# EAGLE design main board +opto 6 motor (EAGLE 9.6.2)
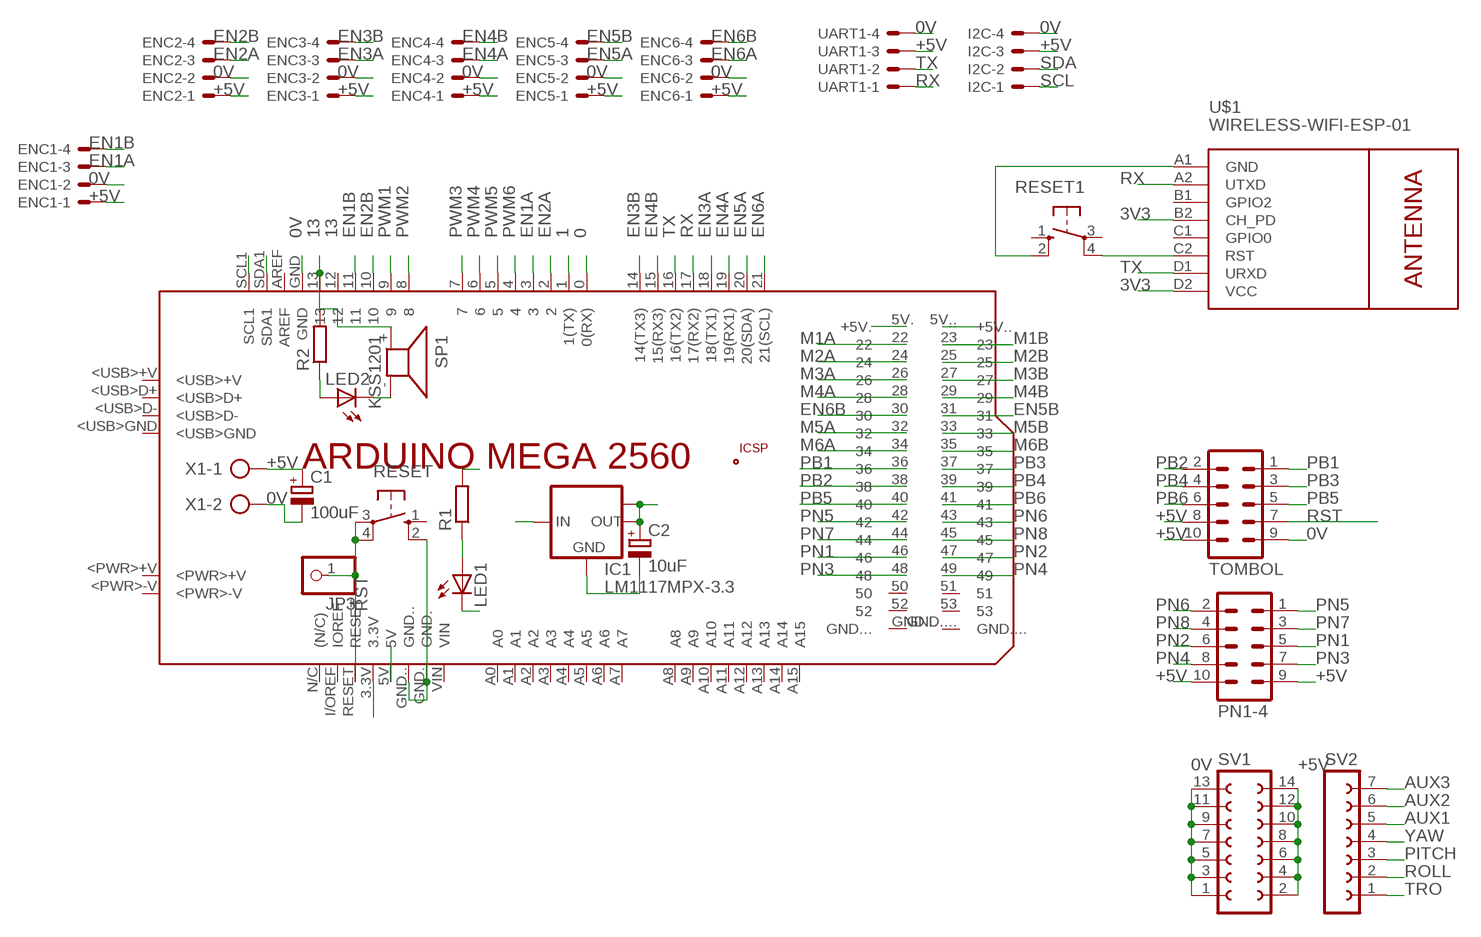
[diagram p0: schematic, sheet 1, part 1 of 2]
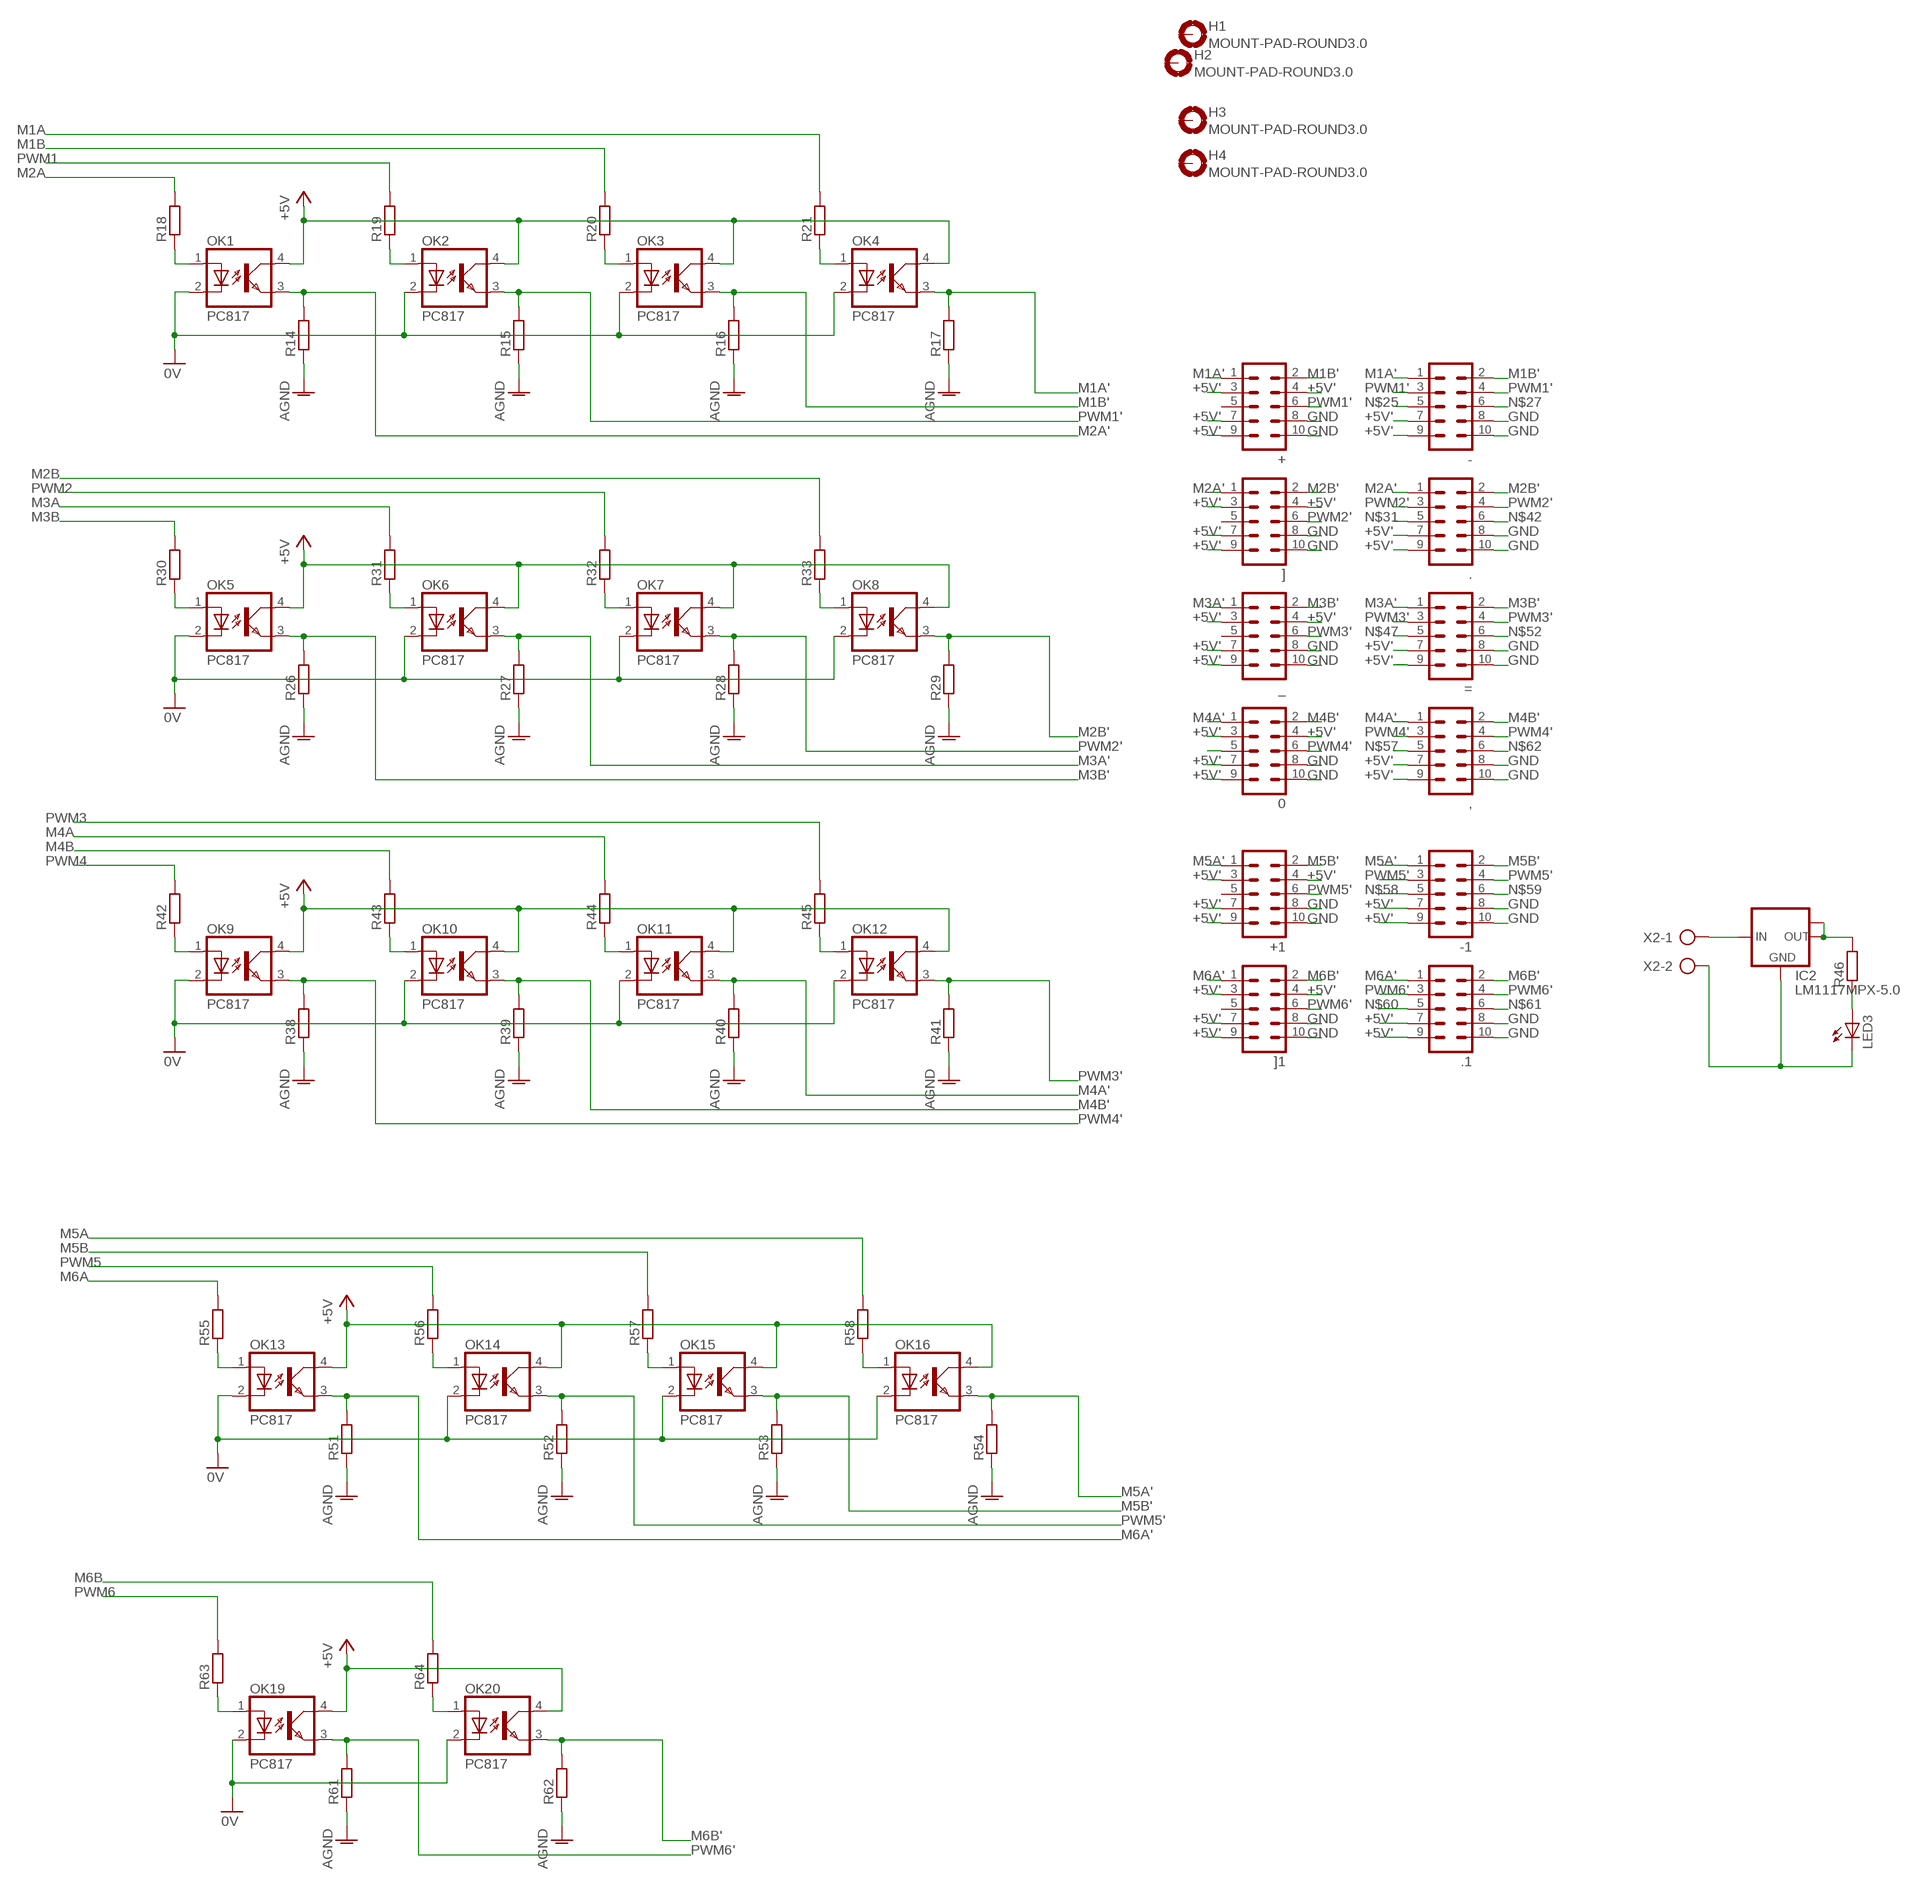
[diagram p1: schematic, sheet 1, part 2 of 2]

## Parts
0  ML10  [ML10]
+  ML10  [ML10]
+1  ML10  [ML10]
,  ML10  [ML10]
-  ML10  [ML10]
-1  ML10  [ML10]
.  ML10  [ML10]
.1  ML10  [ML10]
=  ML10  [ML10]
]  ML10  [ML10]
]1  ML10  [ML10]
_  ML10  [ML10]
C1  100uF  CPOL-EUE2.5-5  [E2,5-5]
C2  10uF  CPOL-EUE2.5-5  [E2,5-5]
ENC1  22-23-2041  [22-23-2041]
ENC2  22-23-2041  [22-23-2041]
ENC3  22-23-2041  [22-23-2041]
ENC4  22-23-2041  [22-23-2041]
ENC5  22-23-2041  [22-23-2041]
ENC6  22-23-2041  [22-23-2041]
H1  MOUNT-PAD-ROUND3.0  [3,0-PAD]
H2  MOUNT-PAD-ROUND3.0  [3,0-PAD]
H3  MOUNT-PAD-ROUND3.0  [3,0-PAD]
H4  MOUNT-PAD-ROUND3.0  [3,0-PAD]
I2C  22-23-2041  [22-23-2041]
IC1  LM1117MPX-3.3  [SOT223]
IC2  LM1117MPX-5.0  [SOT223]
JP3  PINHD-1X1  [1X01]
LED1  LED3MM  [LED3MM]
LED2  LED3MM  [LED3MM]
LED3  LED3MM  [LED3MM]
OK1  PC817  [DIL04]
OK2  PC817  [DIL04]
OK3  PC817  [DIL04]
OK4  PC817  [DIL04]
OK5  PC817  [DIL04]
OK6  PC817  [DIL04]
OK7  PC817  [DIL04]
OK8  PC817  [DIL04]
OK9  PC817  [DIL04]
OK10  PC817  [DIL04]
OK11  PC817  [DIL04]
OK12  PC817  [DIL04]
OK13  PC817  [DIL04]
OK14  PC817  [DIL04]
OK15  PC817  [DIL04]
OK16  PC817  [DIL04]
OK19  PC817  [DIL04]
OK20  PC817  [DIL04]
PCB1  ARDUINO_MEGA2560  [ARDUINO_MEGA2560]
PN1-4  ML10  [ML10]
R1  R-EU_M0805  [M0805]
R2  R-EU_M0805  [M0805]
R14  R-EU_M0805  [M0805]
R15  R-EU_M0805  [M0805]
R16  R-EU_M0805  [M0805]
R17  R-EU_M0805  [M0805]
R18  R-EU_M0805  [M0805]
R19  R-EU_M0805  [M0805]
R20  R-EU_M0805  [M0805]
R21  R-EU_M0805  [M0805]
R26  R-EU_M0805  [M0805]
R27  R-EU_M0805  [M0805]
R28  R-EU_M0805  [M0805]
R29  R-EU_M0805  [M0805]
R30  R-EU_M0805  [M0805]
R31  R-EU_M0805  [M0805]
R32  R-EU_M0805  [M0805]
R33  R-EU_M0805  [M0805]
R38  R-EU_M0805  [M0805]
R39  R-EU_M0805  [M0805]
R40  R-EU_M0805  [M0805]
R41  R-EU_M0805  [M0805]
R42  R-EU_M0805  [M0805]
R43  R-EU_M0805  [M0805]
R44  R-EU_M0805  [M0805]
R45  R-EU_M0805  [M0805]
R46  R-EU_0207/10  [0207/10]
R51  R-EU_M0805  [M0805]
R52  R-EU_M0805  [M0805]
R53  R-EU_M0805  [M0805]
R54  R-EU_M0805  [M0805]
R55  R-EU_M0805  [M0805]
R56  R-EU_M0805  [M0805]
R57  R-EU_M0805  [M0805]
R58  R-EU_M0805  [M0805]
R61  R-EU_M0805  [M0805]
R62  R-EU_M0805  [M0805]
R63  R-EU_M0805  [M0805]
R64  R-EU_M0805  [M0805]
RESET  40-XX  [B3F-40XX]
RESET1  40-XX  [B3F-40XX]
SP1  KSS1201  [KSS1201]
SV1  FE07-2  [FE07-2]
SV2  FE07-1  [FE07]
TOMBOL  ML10  [ML10]
U$1  WIRELESS-WIFI-ESP-01  [WIRELESS-WIFI-ESP-01]
UART1  22-23-2041  [22-23-2041]
X1  AK500/2  [AK500/2]
X2  AK300/2  [AK300/2]

## Nets
0: PCB1.0(0(RX))
0V: C1.- ENC1.2 ENC2.2 ENC3.2 ENC4.2 ENC5.2 ENC6.2 I2C.4 LED1.K(C) LED2.K(C) OK1.2(C) OK2.2(C) OK3.2(C) OK4.2(C) OK5.2(C) OK6.2(C) OK7.2(C) OK8.2(C) OK9.2(C) OK10.2(C) OK11.2(C) OK12.2(C) OK13.2(C) OK14.2(C) OK15.2(C) OK16.2(C) OK19.2(C) OK20.2(C) PCB1.GND PCB1.GND. PCB1.GND.. RESET.2(S1) SP1.- SV1.1 SV1.3 SV1.5 SV1.7 SV1.9 SV1.11 SV1.13 TOMBOL.9 UART1.4 X1.2
1: PCB1.1(1(TX))
3V3: C2.+ IC1.2(OUT) IC1.TAB(OUT1) PCB1.3.3V U$1.B2(CH_PD) U$1.D2(VCC)
13: PCB1.13 R2.2 SP1.+
+5V: C1.+ ENC1.1 ENC2.1 ENC3.1 ENC4.1 ENC5.1 ENC6.1 I2C.3 IC1.3(IN) PCB1.5V PCB1.5V.(+5V.) PCB1.5V..(+5V..) PN1-4.9 PN1-4.10 R1.2 SV1.2 SV1.4 SV1.6 SV1.8 SV1.10 SV1.12 SV1.14 TOMBOL.8 TOMBOL.10 UART1.3 X1.1
+5V': 0.3 0.4 0.7 0.9 +1.3 +1.4 +1.7 +1.9 +.3 +.4 +.7 +.9 ,.7 ,.9 -1.7 -1.9 -.7 -.9 .1.7 .1.9 ..7 ..9 =.7 =.9 ]1.3 ]1.4 ]1.7 ]1.9 ].3 ].4 ].7 ].9 _.3 _.4 _.7 _.9 IC2.2(OUT) IC2.TAB(OUT1) OK1.4(COL) OK2.4(COL) OK3.4(COL) OK4.4(COL) OK5.4(COL) OK6.4(COL) OK7.4(COL) OK8.4(COL) OK9.4(COL) OK10.4(COL) OK11.4(COL) OK12.4(COL) OK13.4(COL) OK14.4(COL) OK15.4(COL) OK16.4(COL) OK19.4(COL) OK20.4(COL) R46.2 ; supply symbol labelled +5V
AUX1: SV2.5
AUX2: SV2.6
AUX3: SV2.7
EN1A: ENC1.3 PCB1.3
EN1B: ENC1.4 PCB1.11
EN2A: ENC2.3 PCB1.2
EN2B: ENC2.4 PCB1.10
EN3A: ENC3.3 PCB1.18(18(TX1))
EN3B: ENC3.4 PCB1.14(14(TX3))
EN4A: ENC4.3 PCB1.19(19(RX1))
EN4B: ENC4.4 PCB1.15(15(RX3))
EN5A: ENC5.3 PCB1.20(20(SDA))
EN5B: ENC5.4 PCB1.31
EN6A: ENC6.3 PCB1.21(21(SCL))
EN6B: ENC6.4 PCB1.30
GND: 0.8 0.10 +1.8 +1.10 +.8 +.10 ,.8 ,.10 -1.8 -1.10 -.8 -.10 .1.8 .1.10 ..8 ..10 =.8 =.10 ]1.8 ]1.10 ].8 ].10 _.8 _.10 IC2.1(GND) LED3.K(C) R14.1 R15.1 R16.1 R17.1 R26.1 R27.1 R28.1 R29.1 R38.1 R39.1 R40.1 R41.1 R51.1 R52.1 R53.1 R54.1 R61.1 R62.1 X2.2 ; supply symbol labelled AGND
M1A: PCB1.22 R21.2
M1A': +.1 -.1 OK4.3(EMIT) R17.2
M1B: PCB1.23 R20.2
M1B': +.2 -.2 OK3.3(EMIT) R16.2
M2A: PCB1.24 R18.2
M2A': ..1 ].1 OK1.3(EMIT) R14.2
M2B: PCB1.25 R33.2
M2B': ..2 ].2 OK8.3(EMIT) R29.2
M3A: PCB1.26 R31.2
M3A': =.1 _.1 OK6.3(EMIT) R27.2
M3B: PCB1.27 R30.2
M3B': =.2 _.2 OK5.3(EMIT) R26.2
M4A: PCB1.28 R44.2
M4A': 0.1 ,.1 OK11.3(EMIT) R40.2
M4B: PCB1.29 R43.2
M4B': 0.2 ,.2 OK10.3(EMIT) R39.2
M5A: PCB1.32 R58.2
M5A': +1.1 -1.1 OK16.3(EMIT) R54.2
M5B: PCB1.33 R57.2
M5B': +1.2 -1.2 OK15.3(EMIT) R53.2
M6A: PCB1.34 R55.2
M6A': .1.1 ]1.1 OK13.3(EMIT) R51.2
M6B: PCB1.35 R64.2
M6B': .1.2 ]1.2 OK20.3(EMIT) R62.2
N$1: RESET1.2(S1) U$1.A1(GND)
N$3: LED1.A R1.1
N$4: LED2.A R2.1
N$6: C2.- IC1.1(GND)
N$9: OK1.1(A) R18.1
N$10: OK2.1(A) R19.1
N$11: OK3.1(A) R20.1
N$12: OK4.1(A) R21.1
N$13: RESET1.4(P1) U$1.C2(RST)
N$18: OK5.1(A) R30.1
N$19: OK6.1(A) R31.1
N$20: OK7.1(A) R32.1
N$21: OK8.1(A) R33.1
N$25: -.5
N$27: -.6
N$29: LED3.A R46.1
N$30: IC2.3(IN) X2.1
N$31: ..5
N$37: OK9.1(A) R42.1
N$38: OK10.1(A) R43.1
N$39: OK11.1(A) R44.1
N$40: OK12.1(A) R45.1
N$42: ..6
N$43: OK13.1(A) R55.1
N$44: OK14.1(A) R56.1
N$45: OK15.1(A) R57.1
N$46: OK16.1(A) R58.1
N$47: =.5
N$50: OK19.1(A) R63.1
N$51: OK20.1(A) R64.1
N$52: =.6
N$57: ,.5
N$58: -1.5
N$59: -1.6
N$60: .1.5
N$61: .1.6
N$62: ,.6
NC4: 0.5
PB1: PCB1.36 TOMBOL.1
PB2: PCB1.38 TOMBOL.2
PB3: PCB1.37 TOMBOL.3
PB4: PCB1.39 TOMBOL.4
PB5: PCB1.40 TOMBOL.5
PB6: PCB1.41 TOMBOL.6
PITCH: SV2.3
PN1: PCB1.46 PN1-4.5
PN2: PCB1.47 PN1-4.6
PN3: PCB1.48 PN1-4.7
PN4: PCB1.49 PN1-4.8
PN5: PCB1.42 PN1-4.1
PN6: PCB1.43 PN1-4.2
PN7: PCB1.44 PN1-4.3
PN8: PCB1.45 PN1-4.4
PWM1: PCB1.9 R19.2
PWM1': +.6 -.3 -.4 OK2.3(EMIT) R15.2
PWM2: PCB1.8 R32.2
PWM2': ..3 ..4 ].6 OK7.3(EMIT) R28.2
PWM3: PCB1.7 R45.2
PWM3': =.3 =.4 _.6 OK12.3(EMIT) R41.2
PWM4: PCB1.6 R42.2
PWM4': 0.6 ,.3 ,.4 OK9.3(EMIT) R38.2
PWM5: PCB1.5 R56.2
PWM5': +1.6 -1.3 -1.4 OK14.3(EMIT) R52.2
PWM6: PCB1.4 R63.2
PWM6': .1.3 .1.4 ]1.6 OK19.3(EMIT) R61.2
ROLL: SV2.2
RST: JP3.1 PCB1.RESET RESET.3(P) RESET.4(P1) TOMBOL.7
RX: PCB1.17(17(RX2)) U$1.A2(UTXD) UART1.1
SCL: I2C.1 PCB1.SCL1
SDA: I2C.2 PCB1.SDA1
TRO: SV2.1
TX: PCB1.16(16(TX2)) U$1.D1(URXD) UART1.2
YAW: SV2.4
Unconnected: +1.5 +.5 ]1.5 ].5 _.5 H1.B3,0(MOUNT) H2.B3,0(MOUNT) H3.B3,0(MOUNT) H4.B3,0(MOUNT) PCB1.12 PCB1.50 PCB1.51 PCB1.52 PCB1.53 PCB1.<PWR>+V PCB1.<PWR>-V PCB1.<USB>+V PCB1.<USB>D+ PCB1.<USB>D- PCB1.<USB>GND PCB1.A0 PCB1.A1 PCB1.A2 PCB1.A3 PCB1.A4 PCB1.A5 PCB1.A6 PCB1.A7 PCB1.A8 PCB1.A9 PCB1.A10 PCB1.A11 PCB1.A12 PCB1.A13 PCB1.A14 PCB1.A15 PCB1.AREF PCB1.GND... PCB1.GND.... PCB1.I/OREF(IOREF) PCB1.N/C((N/C)) PCB1.VIN RESET1.1(S) RESET1.3(P) RESET.1(S) U$1.B1(GPIO2) U$1.C1(GPIO0)

## Library data of the parts
0 + +1 , - -1 . .1 = ] ]1 _ PN1-4 TOMBOL = con-harting-ml:ML10: HARTING; OC_FARNELL: unknown; OC_NEWARK: unknown
C1 C2 = rcl:CPOL-EU: POLARIZED CAPACITOR, European symbol
ENC1-ENC6 I2C UART1 = con-molex:22-23-2041: .100" (2.54mm) Center Header - 4 Pin; MF: MOLEX; MPN: 22-23-2041; OC_FARNELL: 1462920; OC_NEWARK: 38C0355
H1-H4 = holes:MOUNT-PAD-ROUND: MOUNTING PAD, round
IC1 IC2 = lm1117:LM1117MPX-*
JP3 = pinhead:PINHD-1X1: PIN HEADER
LED1-LED3 = led:LED: LED OSRAM: - CHIPLED LG R971, LG N971, LY N971, LG Q971, LY Q971, LO R971, LY R971 LH N974, LH R974 LS Q976, LO Q976, LY Q976 LO Q996 - Hyper CHIPLED LW Q18S LB Q993, LB Q99A, LB R99A - SideLED LS A670, LO A670, LY A670, LG A670, LP A670 LB A673, LV A673, LT A673, LW A673 LH A674 LY A675 LS A676, LA A676, LO A676, LY A676, LW A676 LS A679, LY A679, LG A679 - Hyper Micro SIDELED® LS Y876, LA Y876, LO Y876, LY Y876 LT Y87S - SmartLED LW L88C, LW L88S LB L89C, LB L89S, LG L890 LS L89K, LO L89K, LY L89K LS L896, LA L896, LO L896, LY L896 - TOPLED LS T670, LO T670, LY T670, LG T670, LP T670 LSG T670, LSP T670, LSY T670, LOP T670, LYG T670 LG T671, LOG T671, LSG T671 LB T673, LV T673, LT T673, LW T673 LH T674 LS T676, LA T676, LO T676, LY T676, LB T676, LH T676, LSB T676, LW T676 LB T67C, LV T67C, LT T67C, LS T67K, LO T67K, LY T67K, LW E67C LS E67B, LA E67B, LO E67B, LY E67B, LB E67C, LV E67C, LT E67C LW T67C LS T679, LY T679, LG T679 LS T770, LO T770, LY T770, LG T770, LP T770 LB T773, LV T773, LT T773, LW T773 LH T774 LS E675, LA E675, LY E675, LS T675 LS T776, LA T776, LO T776, LY T776, LB T776 LHGB T686 LT T68C, LB T68C - Hyper Mini TOPLED® LB M676 - Mini TOPLED Santana® LG M470 LS M47K, LO M47K, LY M47K Source: http://www.osram.convergy.de LUXEON: - LUMILED® LXK2-PW12-R00, LXK2-PW12-S00, LXK2-PW14-U00, LXK2-PW14-V00 LXK2-PM12-R00, LXK2-PM12-S00, LXK2-PM14-U00 LXK2-PE12-Q00, LXK2-PE12-R00, LXK2-PE12-S00, LXK2-PE14-T00, LXK2-PE14-U00 LXK2-PB12-K00, LXK2-PB12-L00, LXK2-PB12-M00, LXK2-PB14-N00, LXK2-PB14-P00, LXK2-PB14-Q00 LXK2-PR12-L00, LXK2-PR12-M00, LXK2-PR14-Q00, LXK2-PR14-R00 LXK2-PD12-Q00, LXK2-PD12-R00, LXK2-PD12-S00 LXK2-PH12-R00, LXK2-PH12-S00 LXK2-PL12-P00, LXK2-PL12-Q00, LXK2-PL12-R00 Source: www.luxeon.com KINGBRIGHT: KA-3528ASYC Source: www.kingbright.com
OK1-OK16 OK19 OK20 = optocoupler:PC817: SHARP OPTO COUPLER; MPN: PC817X4J000F; OC_FARNELL: 9707727; OC_NEWARK: 97K7059
PCB1 = Arduino:ARDUINO_MEGA2560: Device for representing an Arduino Mega 2560 board with a footprint in an EAGLE design. Created by Dave Young for Element14. More EAGLE documentation at: http://www.element14.com/community/community/knode/cadsoft_eagle
R1 R2 R14-R21 R26-R33 R38-R46 R51-R58 R61-R64 = rcl:R-EU_: RESISTOR, European symbol
RESET RESET1 = switch-omron:40-XX: OMRON SWITCH; MF: OMRON COMPONENTS USA; MPN: B3F-4000; OC_FARNELL: 176434; OC_NEWARK: 36K3105
SP1 = buzzer:KSS1201: SPEAKER Source: Schukat; OC_FARNELL: unknown; OC_NEWARK: unknown
SV1 = con-lsta:FE07-2: FEMALE HEADER; OC_FARNELL: unknown; OC_NEWARK: unknown
SV2 = con-lsta:FE07-1: FEMALE HEADER; OC_FARNELL: unknown; OC_NEWARK: unknown
U$1 = ESP-01:WIRELESS-WIFI-ESP-01: Wireless Wi-Fi ESP-01 Module based on ESP8266 chip Click here to find device on ebay.com <http://www.ebay.com/sch/esp8266+esp+01+transceiver>
X1 = con-ptr500:AK500/2: CONNECTOR; OC_FARNELL: unknown; OC_NEWARK: unknown
X2 = con-ptr500:AK300/2: CONNECTOR; OC_FARNELL: unknown; OC_NEWARK: unknown

## Board
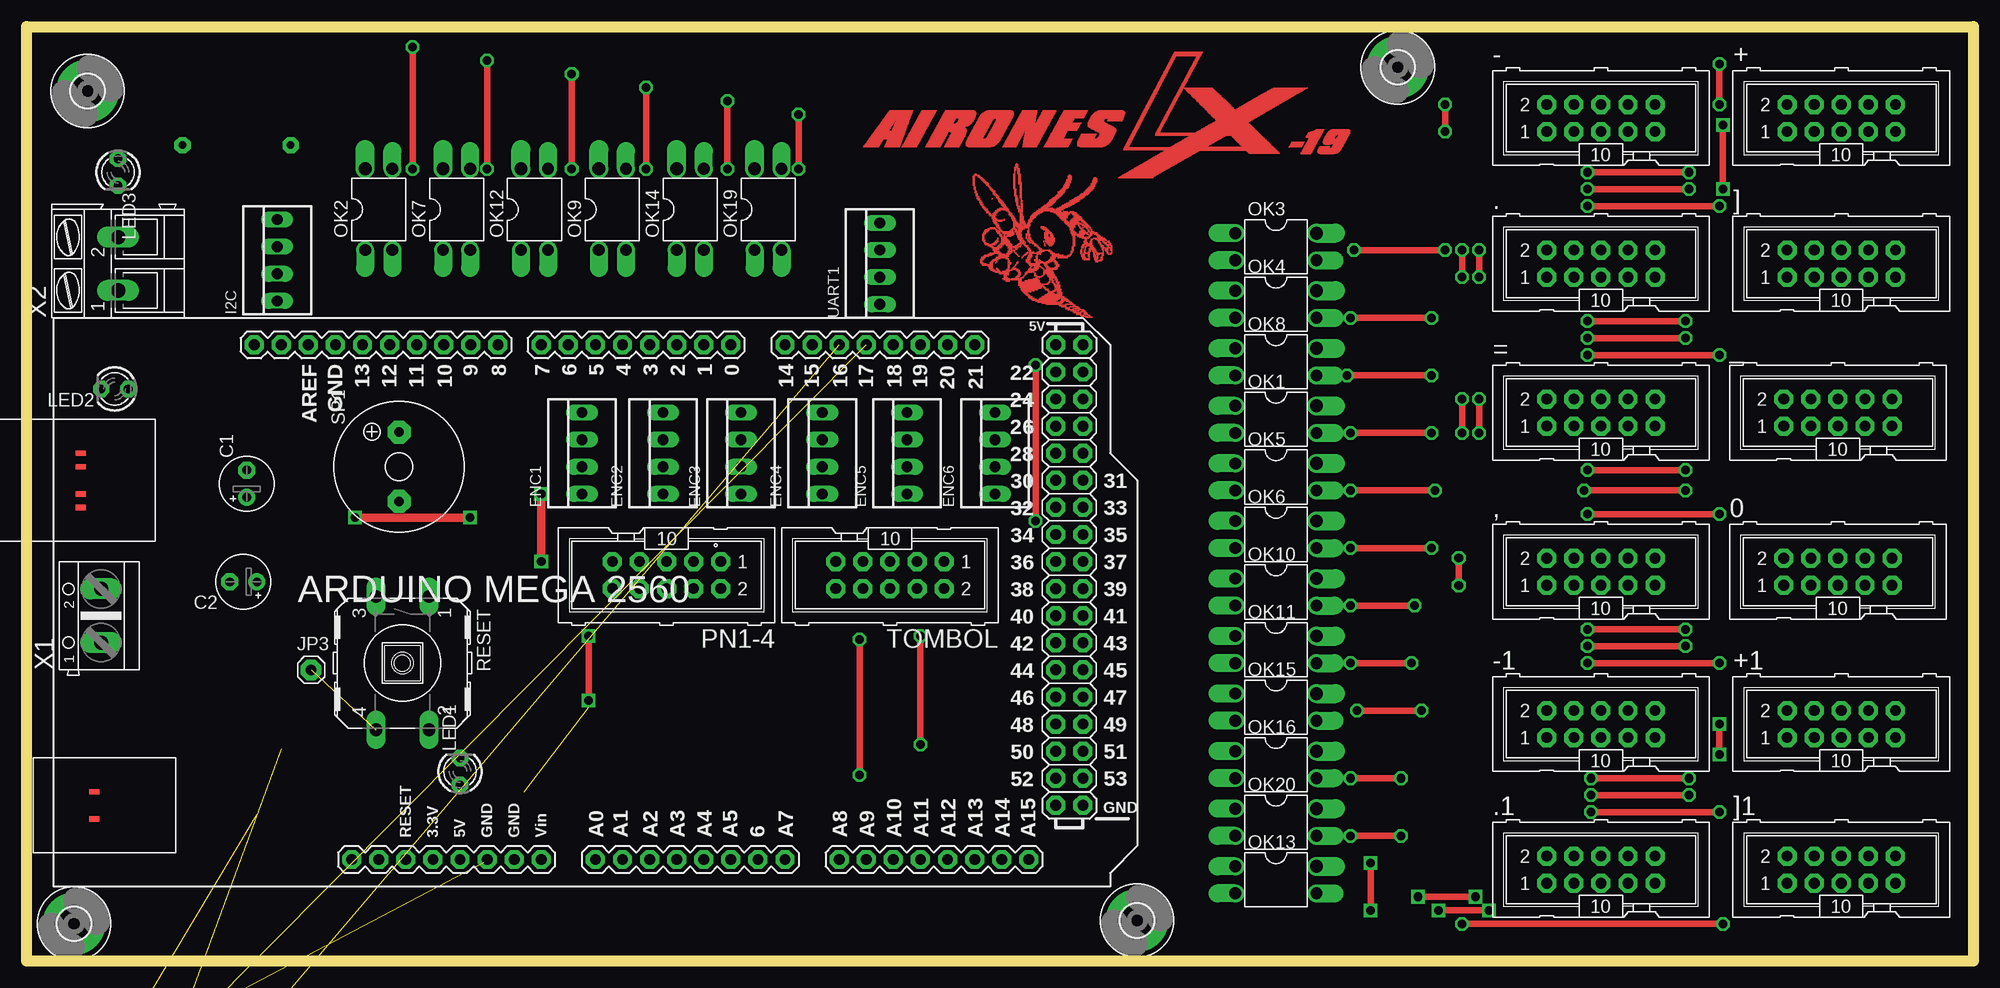
[diagram p2: board, top side]
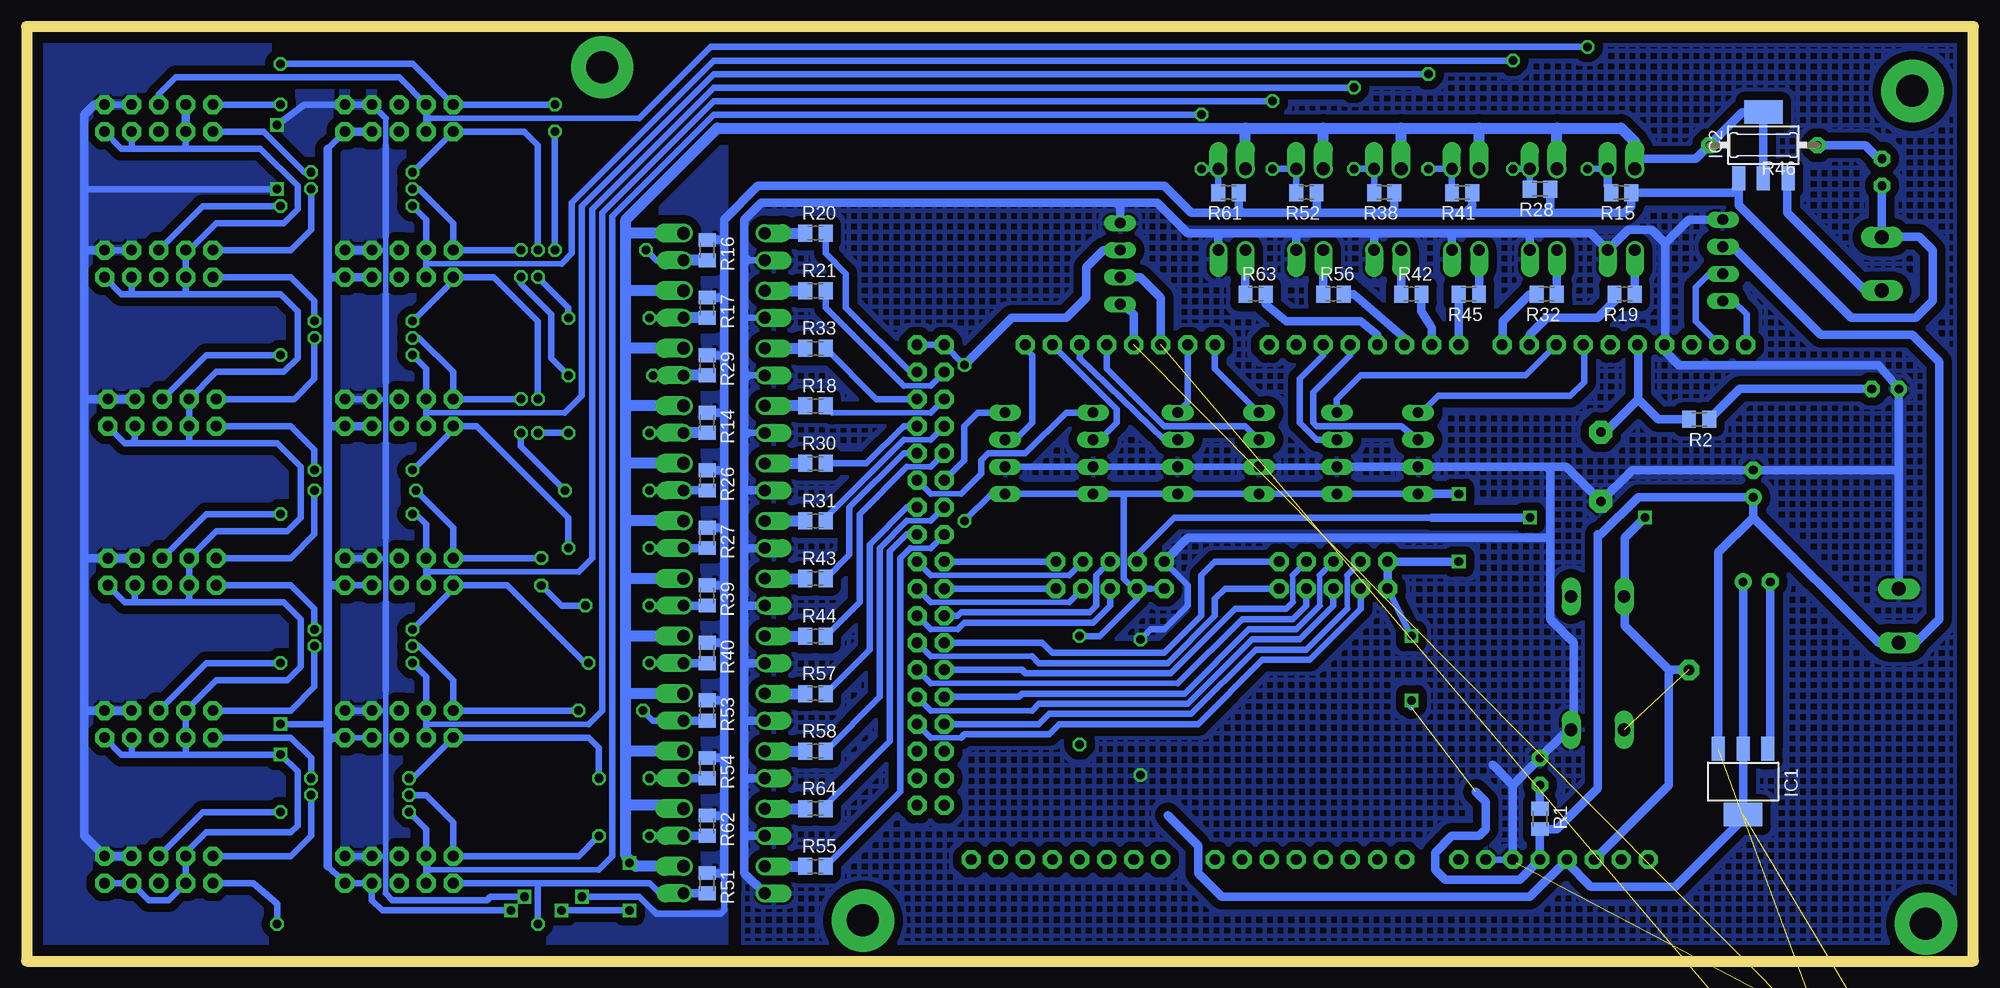
[diagram p3: board, bottom side, seen from below]

Size 182.56 x 87.63 mm. Coordinates in mm from the lower left corner, seen from the top.
Outline: 0,87.63 182.56,87.63 182.56,0 0,0 0,87.63
Copper layers (1*16): Top 0.035mm / dielectric 1.5mm / Bottom 0.035mm
Design rules "default": minimum track width 10mil, minimum drill 24mil, track to track 8mil, track to pad 8mil, pad to pad 8mil, via to via 8mil, smd to smd 8mil, copper to edge 40mil, drill to drill 8mil, minimum pad ring 10mil, minimum via ring 8mil, stop-mask expansion 4mil, vias tented up to drill 0mil, thermal gap 10mil

### Footprints (pad centres in the part's own frame; a part is rotated, then mirrored left to right if it is on the bottom)
ML10 = drill 1 pad 1.778 octagon: 1 -5.08,-1.27; 2 -5.08,1.27; 3 -2.54,-1.27; 4 -2.54,1.27; 5 0,-1.27; 6 0,1.27; 7 2.54,-1.27; 8 2.54,1.27; 9 5.08,-1.27; 10 5.08,1.27
E2,5-5 = drill 0.813 pad 1.6: + -1.27,0 | drill 0.813 pad 1.6 octagon: - 1.27,0
22-23-2041 = drill 1 long: 1 -3.81,0; 2 -1.27,0; 3 1.27,0; 4 3.81,0
3,0-PAD = drill 3 pad 5.842: B3,0 0,0
SOT223 = smd 1.219 x 2.235: 1 -2.311,-3.099; 2 0,-3.099; 3 2.311,-3.099 | smd 3.6 x 2.2: TAB 0,3.099
1X01 = drill 1 pad 1.93 octagon: 1 0,0
LED3MM = drill 0.813 pad 1.524 octagon: A -1.27,0; K 1.27,0
DIL04 = drill 1.1 pad 1.676 offset: 1 -1.27,-3.81; 2 1.27,-3.81; 3 1.27,3.81 | drill 1.2 pad 1.676 offset: 4 -1.27,3.81
ARDUINO_MEGA2560 = drill 1.016 pad 1.778 octagon: 0 63.5,50.8; 1 60.96,50.8; 2 58.42,50.8; 3 55.88,50.8; 3.3V 35.56,2.54; 4 53.34,50.8; 5 50.8,50.8; 5V 38.1,2.54; 5V. 93.98,50.8; 5V.. 96.52,50.8; 6 48.26,50.8; 7 45.72,50.8; 8 41.656,50.8; 9 39.116,50.8; 10 36.576,50.8; 11 34.036,50.8; 12 31.496,50.8; 13 28.956,50.8; 14 68.58,50.8; 15 71.12,50.8; 16 73.66,50.8; 17 76.2,50.8; 18 78.74,50.8; 19 81.28,50.8; 20 83.82,50.8; 21 86.36,50.8; 22 93.98,48.26; 23 96.52,48.26; 24 93.98,45.72; 25 96.52,45.72; 26 93.98,43.18; 27 96.52,43.18; 28 93.98,40.64; 29 96.52,40.64; 30 93.98,38.1; 31 96.52,38.1; 32 93.98,35.56; 33 96.52,35.56; 34 93.98,33.02; 35 96.52,33.02; 36 93.98,30.48; 37 96.52,30.48; 38 93.98,27.94; 39 96.52,27.94; 40 93.98,25.4; 41 96.52,25.4; 42 93.98,22.86; 43 96.52,22.86; 44 93.98,20.32; 45 96.52,20.32; 46 93.98,17.78; 47 96.52,17.78; 48 93.98,15.24; 49 96.52,15.24; 50 93.98,12.7; 51 96.52,12.7; 52 93.98,10.16; 53 96.52,10.16; A0 50.8,2.54; A1 53.34,2.54; A2 55.88,2.54; A3 58.42,2.54; A4 60.96,2.54; A5 63.5,2.54; A6 66.04,2.54; A7 68.58,2.54; A8 73.66,2.54; A9 76.2,2.54; A10 78.74,2.54; A11 81.28,2.54; A12 83.82,2.54; A13 86.36,2.54; A14 88.9,2.54; A15 91.44,2.54; AREF 23.876,50.8; GND 26.416,50.8; GND. 43.18,2.54; GND.. 40.64,2.54; GND... 93.98,7.62; GND.... 96.52,7.62; I/OREF 30.48,2.54; N/C 27.94,2.54; RESET 33.02,2.54; SCL1 18.796,50.8; SDA1 21.336,50.8; VIN 45.72,2.54 | smd 1.016 x 0.508: <PWR>+V 3.81,8.89; <PWR>-V 3.81,6.35; <USB>+V 2.54,40.64; <USB>D+ 2.54,39.37; <USB>D- 2.54,36.83; <USB>GND 2.54,35.56
M0805 = smd 1.3 x 1.6: 1 -0.95,0; 2 0.95,0
0207/10 = drill 0.7 pad 1.524 octagon: 1 -5.08,0; 2 5.08,0
B3F-40XX = drill 1.194 long: 1 -6.248,2.489; 2 6.248,2.489; 3 -6.248,-2.489; 4 6.248,-2.489
KSS1201 = drill 0.914 pad 2.159 octagon: + 3.251,0; - -3.251,0
FE07-2 = drill 0.914: 1 -7.62,1.27 | drill 0.914 octagon: 2 -7.62,-1.27; 3 -5.08,1.27; 4 -5.08,-1.27; 5 -2.54,1.27; 6 -2.54,-1.27; 7 0,1.27; 8 0,-1.27; 9 2.54,1.27; 10 2.54,-1.27; 11 5.08,1.27; 12 5.08,-1.27; 13 7.62,1.27; 14 7.62,-1.27
FE07 = drill 0.813 long: 1 -7.62,0; 2 -5.08,0; 3 -2.54,0; 4 0,0; 5 2.54,0; 6 5.08,0; 7 7.62,0
WIRELESS-WIFI-ESP-01 = drill 1 square: A1 -8.89,3.81; D1 -8.89,-3.81 | drill 1: A2 -11.43,3.81; B1 -8.89,1.27; B2 -11.43,1.27; C1 -8.89,-1.27; C2 -11.43,-1.27; D2 -11.43,-3.81
AK500/2 = drill 1.321 long: 1 -2.515,0; 2 2.515,0
AK300/2 = drill 1.321 long: 1 -2.515,0; 2 2.489,0

### Placement (x,y rotation side)
0  169.86,36.51 0 top
+  170.18,79.06 0 top
+1  170.18,22.22 0 top
,  147.64,36.51 0 top
-  147.64,79.06 0 top
-1  147.64,22.22 0 top
.  147.64,65.41 0 top
.1  147.64,8.57 0 top
=  147.64,51.44 0 top
]  170.18,65.41 0 top
]1  170.18,8.57 0 top
_  169.86,51.44 0 top
C1  20.64,44.77 90 top
C2  20.32,35.56 180 top
ENC1  52.07,47.62 90 top
ENC2  59.69,47.62 90 top
ENC3  66.99,47.62 90 top
ENC4  74.61,47.62 90 top
ENC5  82.55,47.62 90 top
ENC6  90.81,47.62 90 top
H1  5.72,81.6 180 top
H2  128.59,83.82 0 top
H3  104.14,3.81 0 top
H4  4.45,3.49 0 top
I2C  23.5,65.72 90 top
IC1  21.59,16.83 180 bottom
IC2  19.69,76.52 0 bottom
JP3  26.67,27.3 0 top
LED1  40.64,17.78 90 top
LED2  8.26,53.66 180 top
LED3  8.57,73.98 270 top
OK1  117.16,50.8 270 top
OK2  33.02,70.48 0 top
OK3  117.16,66.99 270 top
OK4  117.16,61.6 270 top
OK5  117.16,45.4 270 top
OK6  117.16,40.01 270 top
OK7  40.32,70.48 0 top
OK8  117.16,56.2 270 top
OK9  54.93,70.48 0 top
OK10  117.16,34.61 270 top
OK11  117.16,29.21 270 top
OK12  47.62,70.48 0 top
OK13  117.16,7.62 270 top
OK14  62.23,70.48 0 top
OK15  117.16,23.81 270 top
OK16  117.16,18.41 270 top
OK19  69.53,70.48 0 top
OK20  117.16,13.02 270 top
PCB1  2.54,6.99 0 top
PN1-4  60.01,36.2 180 top
R1  40.64,13.33 270 bottom
R2  25.72,50.8 180 bottom
R14  118.75,50.48 270 bottom
R15  33.02,72.07 180 bottom
R16  118.75,66.67 270 bottom
R17  118.75,61.28 270 bottom
R18  108.59,52.07 0 bottom
R19  32.7,62.55 180 bottom
R20  108.59,68.26 0 bottom
R21  108.59,62.87 0 bottom
R26  118.75,45.09 270 bottom
R27  118.75,39.69 270 bottom
R28  40.64,72.39 180 bottom
R29  118.75,55.88 270 bottom
R30  108.59,46.67 0 bottom
R31  108.59,41.28 0 bottom
R32  40,62.55 180 bottom
R33  108.59,57.47 0 bottom
R38  55.25,72.07 180 bottom
R39  118.75,34.29 270 bottom
R40  118.75,28.89 270 bottom
R41  47.94,72.07 180 bottom
R42  52.71,62.55 0 bottom
R43  108.59,35.88 0 bottom
R44  108.59,30.48 0 bottom
R45  47.31,62.55 180 bottom
R46  19.69,76.52 180 bottom
R51  118.75,7.3 270 bottom
R52  62.55,72.07 180 bottom
R53  118.75,23.49 270 bottom
R54  118.75,18.1 270 bottom
R55  108.59,8.89 0 bottom
R56  60.01,62.55 0 bottom
R57  108.59,25.08 0 bottom
R58  108.59,19.68 0 bottom
R61  69.85,72.07 180 bottom
R62  118.75,12.7 270 bottom
R63  67.31,62.55 0 bottom
R64  108.59,14.29 0 bottom
RESET  35.24,27.94 270 top
RESET1  4.47,-46.62 0 top  (outside the outline)
SP1  34.92,46.36 90 top
SV1  5.72,-7.62 0 top  (outside the outline)
SV2  5.72,-11.43 0 top  (outside the outline)
TOMBOL  80.96,36.2 180 top
U$1  8.97,-27.82 0 top  (outside the outline)
UART1  80.01,65.41 90 top
X1  6.98,32.39 90 top
X2  8.57,65.41 90 top

### Tracks (layer width: path | path; a pad name or v marks a point on that pad's centre or on a via)
0V  (via drill 0.8 pad 1.27)  (7 unrouted)
  Top 0.61: v78.1,30.16 v78.1,17.46
  Bottom 0.61: ENC6.2 ENC5.2 ENC4.2 ENC3.2 ENC2.2 | 42.86,9.21 PCB1.GND.. PCB1.GND. | TOMBOL.9 73.66,35.24 73.66,33.34 75.88,31.11 77.15,31.11 v78.1,30.16 | OK1.2 114.94,49.53 | OK8.2 115.25,54.93 | OK4.2 114.94,60.32 115.25,60.64 | OK3.2 115.25,65.72
  Bottom 0.813: 41.59,68.26 35.88,68.26 OK2.2 32.39,68.58 30.16,68.58 28.89,67.31 | 41.59,68.26 48.9,68.26 | 48.9,68.26 56.2,68.26 | 56.2,68.26 63.5,68.26 | 63.5,68.26 70.8,68.26 | 115.25,66.04 115.25,69.53 113.66,71.12 80.33,71.12 | 115.25,66.04 115.25,65.72 115.25,60.64 115.25,54.93 115.25,54.61 | 115.25,54.61 115.25,49.21 | 115.25,49.21 115.25,44.13 | 115.25,44.13 115.25,38.73 | 115.25,38.73 115.25,33.34 | 115.25,33.34 115.25,27.62 | 115.25,27.62 115.25,22.54 | 115.25,22.54 115.25,16.83 | 115.25,16.83 115.25,11.75 | 115.25,11.75 115.25,8.25 OK13.2 | OK20.2 115.25,11.75 | OK16.2 114.94,17.14 115.25,16.83 | OK15.2 115.25,22.54 | OK11.2 114.94,27.94 115.25,27.62 | OK10.2 115.25,33.34 | OK6.2 115.25,38.73 | OK5.2 115.25,44.13 | 114.94,49.53 115.25,49.21 | 114.94,54.93 115.25,54.61 | 114.94,65.72 115.25,66.04 | OK19.2 70.8,68.26 | OK14.2 63.5,68.26 | OK9.2 56.2,68.26 | OK12.2 48.9,68.26 | OK7.2 41.59,68.26 | 28.89,67.31 28.89,57.85 PCB1.GND 28.96,57.21 27.62,55.88 8.89,55.88 LED2.K 6.98,46.04 | 70.8,68.26 73.66,68.26 76.52,71.12 80.33,71.12 | UART1.4 80.01,70.8 80.33,71.12 | I2C.4 26.67,69.53 28.89,67.31 | 37.47,21.43 37.47,29.85 39.69,32.07 39.69,39.69 | 37.47,21.43 37.47,21.27 38.42,21.27 LED1.K 40.96,19.05 40.96,18.73 43.18,16.51 | 37.47,21.43 RESET.2 | 43.18,16.51 PCB1.GND.. | X1.2 6.98,46.04 | 6.98,46.04 C1.- 31.99,46.04 SP1.- 38.18,46.36 40,46.36 | ENC2.2 ENC1.2 40,46.36 | 39.69,39.69 73.66,39.69 TOMBOL.9 | 45.09,18.41 43.18,16.51 | 39.69,39.69 39.69,46.04 40,46.36
  pour Bottom (isolate 0.8, hatched): -1.13,88.68 115.06,88.68 115.37,-1.02 -1.13,-0.92
3V3  (2 unrouted)
  Bottom 0.813: 75.56,13.65 72.71,10.79 72.71,8.25 70.49,6.03 41.59,6.03 PCB1.3.3V 38.1,9.21 35.88,6.99 27.94,6.99 21.59,13.33 IC1.TAB IC1.2 C2.+
13
  Bottom 0.813: SP1.+ 34.53,49.61 31.43,52.71 | 31.43,52.71 31.43,57.72 PCB1.13 | R2.2 29.53,50.8 31.43,52.71
+5V  (via drill 0.8 pad 1.27)  (8 unrouted)
  Top 0.61: v94.62,41.28 v94.62,55.88 | v83.82,30.48 v83.82,20.32 | v52.71,30.48 v52.71,24.45
  Top 0.813: v48.26,37.47 v48.26,43.82
  Bottom 0.51: TOMBOL.10 77.15,34.93 TOMBOL.8
  Bottom 0.61: v94.62,41.28 92.08,43.82 ENC6.1 ENC5.1 79.69,43.82 | v94.62,55.88 PCB1.5V. PCB1.5V.. | 79.69,43.82 ENC4.1 ENC3.1 ENC2.1 ENC1.1 | TOMBOL.10 75.88,35.24 | TOMBOL.8 78.42,33.97 81.91,30.48 v83.82,30.48 | PN1-4.10 v52.71,30.48 | v52.71,24.45 52.71,23.81 | 77.15,34.93 78.74,34.93 79.69,35.88 79.69,43.82
  Bottom 0.813: UART1.3 81.6,66.67 83.19,65.09 83.19,62.23 85.09,60.32 90.17,60.32 v94.62,55.88 | 20.64,41.59 8.89,29.85 8.26,29.85 8.23,29.87 X1.1 6.96,29.85 5.4,29.85 3.17,32.07 3.17,56.2 5.72,58.74 14.29,58.74 22.54,66.99 I2C.3 | 20.64,41.59 C1.+ 31.43,43.5 34.92,40.01 35.24,40.01 35.24,16.19 39.05,12.38 R1.2 PCB1.5V 42.55,7.62 49.53,7.62 50.48,8.57 50.48,10.16 48.9,11.75 46.35,11.75 45.72,12.38 45.72,14.92 46.67,15.88 | IC1.3 23.9,38.33 20.64,41.59 | PN1-4.10 PN1-4.9 v48.26,37.47 | v48.26,43.82 ENC1.1
+5V'  (via drill 0.8 pad 1.27)
  Top 0.61: v137.16,4.76 v132.4,4.76 | v126.05,9.21 v126.05,4.76 | v158.75,19.37 v158.75,22.22
  Bottom 0.51: -1.9 -1.7 | 152.72,7.62 .1.9
  Bottom 0.61: 126.37,9.84 126.37,14.29 126.05,14.61 | 121.92,14.61 121.6,14.29 OK20.4 | 126.05,19.68 126.37,20 126.37,9.52 v126.05,9.21 | 126.05,25.08 126.37,25.4 | 126.05,41.28 126.37,40.96 | 126.05,52.07 126.37,52.39 | 126.05,57.47 126.37,57.15 | ,.9 ,.7 | -.9 154.31,76.2 | 167.64,19.37 v158.75,19.37 157.16,17.78 157.16,12.7 157.8,12.06 165.74,12.06 167.64,10.16 ]1.4 ]1.3 169.23,5.72 171.13,5.72 ]1.7 ]1.9 | 167.64,19.37 172.72,19.37 | 172.72,19.37 173.67,19.37 +1.9 | +1.7 172.72,19.37 | 167.64,19.37 +1.3 +1.4 164.78,26.35 158.12,26.35 156.84,27.62 156.84,32.07 158.43,33.66 167.64,33.66 | 167.64,33.66 172.4,33.66 | 172.4,33.66 173.35,33.66 0.9 | 0.7 172.4,33.66 | 167.64,33.66 167.32,33.97 0.3 0.4 164.78,40.32 158.12,40.32 156.84,41.59 156.84,46.36 159.07,48.58 167.32,48.58 | 167.32,48.58 172.72,48.58 | 172.72,48.58 173.35,48.58 _.9 | _.7 172.4,48.9 172.72,48.58 | 167.32,48.58 _.3 _.4 164.78,55.25 158.43,55.25 157.16,56.52 157.16,60.96 158.75,62.55 167.64,62.55 | 167.64,62.55 172.72,62.55 | 172.72,62.55 173.67,62.55 ].9 | ].7 172.72,62.55 | 167.64,62.55 ].3 ].4 167.32,66.67 164.78,69.21 158.43,69.21 157.16,70.48 157.16,72.71 160.66,76.2 167.96,76.2 | 167.96,76.2 172.72,76.2 | 172.72,76.2 173.67,76.2 +.9 | +.7 172.72,76.2 | +.3 167.64,76.52 167.96,76.2 | v137.16,4.76 149.22,4.76 150.18,5.72 .1.7 .1.9 | v132.4,4.76 v126.05,4.76 | 152.72,7.62 153.03,7.62 154.31,8.89 | v158.75,22.22 154.31,22.22
  Bottom 0.813: 154.31,76.2 154.31,64.13 | 154.31,64.13 154.31,50.16 | 154.31,50.16 154.31,35.24 | 154.31,35.24 154.31,22.22 154.31,20.64 | 154.31,20.64 154.31,8.89 | ..7 ..9 154.31,64.13 | =.7 =.9 154.31,50.16 | ,.9 154.31,35.24 | -1.9 153.99,20.95 154.31,20.64 | -.7 -.9 | +.4 +.3 | 31.75,75.56 31.43,75.56 31.12,75.25 26.03,75.25 R46.2 21.67,79.62 IC2.TAB IC2.2
  Bottom 1.016: OK13.4 125.41,8.89 126.37,9.84 126.37,19.37 | 126.37,19.37 126.37,20 126.37,25.4 126.37,30.48 | 126.37,30.48 126.37,35.56 | 126.37,35.56 126.37,40.96 126.37,46.99 | 126.37,46.99 126.37,52.39 126.37,57.15 126.37,62.87 | 126.37,62.87 126.37,68.26 | 126.37,68.26 126.37,69.53 117.79,78.1 68.26,78.1 | 68.26,78.1 60.96,78.1 | 60.96,78.1 53.66,78.1 | 53.66,78.1 46.35,78.1 | 46.35,78.1 39.05,78.1 | 39.05,78.1 33.02,78.1 31.75,76.83 31.75,75.56 OK2.4 | OK7.4 39.05,78.1 | OK12.4 46.35,78.1 | OK9.4 53.66,78.1 | OK14.4 60.96,78.1 | OK19.4 68.26,78.1 | OK3.4 126.37,68.26 | OK4.4 126.37,62.87 | OK8.4 126.05,57.47 | OK1.4 126.05,52.07 | 121.92,14.61 126.05,14.61 | OK16.4 126.05,19.68 126.37,19.37 | OK15.4 126.05,25.08 | OK11.4 126.37,30.48 | OK10.4 126.05,35.88 126.37,35.56 | OK6.4 126.05,41.28 | OK5.4 126.05,46.67 126.37,46.99
EN1A
  Bottom 0.61: ENC1.3 53.66,50.16 61.59,50.16 61.91,50.48 61.91,53.34 58.42,56.83 PCB1.3
EN1B
  Bottom 0.61: PCB1.11 36.51,57.72 36.51,54.29 37.78,53.02 50.16,53.02 51.75,51.44 ENC1.4
EN2A
  Bottom 0.61: ENC2.3 61.59,48.9 63.18,50.48 63.18,54.61 60.96,56.83 PCB1.2
EN2B
  Bottom 0.61: PCB1.10 41.97,54.93 57.47,54.93 59.69,52.71 ENC2.4
EN3A
  Bottom 0.61: ENC3.3 68.26,50.16 75.88,50.16 81.28,55.56 PCB1.18
EN3B
  Bottom 0.61: ENC3.4 71.12,55.56 PCB1.14
EN4A
  Bottom 0.61: ENC4.3 75.88,48.9 83.82,56.52 PCB1.19
EN4B
  Bottom 0.61: ENC4.4 73.66,52.39 PCB1.15
EN5A
  Bottom 0.61: ENC5.3 81.91,48.9 80.33,50.48 80.33,51.75 PCB1.20
EN5B
  Bottom 0.508: 97.79,43.82 94.93,43.82
  Bottom 0.61: PCB1.31 97.79,43.82 | 94.93,43.82 93.03,45.72 93.03,46.99 92.39,47.62 88.9,47.62 85.09,51.44 ENC5.4
EN6A
  Bottom 0.61: ENC6.3 89.85,48.9 88.27,50.48 88.27,56.83 88.9,57.47 PCB1.21
EN6B
  Bottom 0.61: PCB1.30 94.62,46.99 94.62,50.16 93.34,51.44 ENC6.4
GND  (via drill 0.8 pad 1.27)
  Top 0.61: v159.07,78.42 v159.07,72.39 | v135.89,6.03 v130.49,6.03
  Bottom 0.508: 148.91,19.37 148.91,9.84 148.91,6.35
  Bottom 0.51: 148.91,79.06 148.91,76.52 | 148.91,67.94 148.91,66.67 | 148.91,66.67 148.91,62.55 | 148.91,54.29 148.91,52.71 | 148.91,52.71 148.91,48.58 | 148.91,39.69 148.91,37.78 | 148.91,37.78 148.91,33.66 | 148.91,25.4 148.91,23.49 | 148.91,23.49 148.91,19.37 | .1.8 148.91,9.84 | -1.8 148.91,23.49 | ,.8 148.91,37.78 | =.8 148.91,52.71 | ..8 148.91,66.67
  Bottom 0.61: .1.8 .1.10 | -1.8 -1.10 | ,.8 ,.10 | =.8 =.10 | 148.91,79.06 -.8 -.10 156.53,80.33 v159.07,78.42 | 148.91,76.52 148.91,67.94 | 148.91,62.55 148.91,54.29 | 148.91,48.58 148.91,39.69 | 148.91,33.66 148.91,25.4 | +.8 +.10 | ].8 ].10 | v159.07,72.39 177.16,72.39 | 148.91,6.35 148.27,5.72 139.38,5.72 139.06,6.03 v135.89,6.03 | v130.49,6.03 125.09,6.03 123.51,4.44 117.47,4.44 117.16,4.76 117.16,8.25
  Bottom 0.813: 39.69,70.17 32.7,70.17 32.07,70.8 R15.1 22.54,72.07 22,72.62 | 39.69,70.17 47.62,70.17 | 47.62,70.17 54.29,70.17 | 54.29,70.17 61.59,70.17 | 61.59,70.17 68.58,70.17 | 117.16,67.63 117.16,69.53 113.98,72.71 75.88,72.71 73.34,70.17 68.58,70.17 | 117.16,67.63 117.16,62.55 | 117.16,62.55 117.16,56.83 | 117.16,56.83 117.16,51.12 | 117.16,51.12 117.16,46.04 | 117.16,46.04 117.16,40.64 | 117.16,40.64 117.16,35.24 | 117.16,35.24 117.16,29.85 | 117.16,29.85 117.16,24.45 | 117.16,24.45 117.16,19.05 | 117.16,19.05 117.16,13.65 | 117.16,13.65 117.16,8.25 R51.1 | 152.72,80.01 -.10 | ..10 ..8 | +.10 176.21,80.33 177.16,79.38 177.16,72.39 177.16,66.67 | 177.16,66.67 177.16,52.71 | 177.16,52.71 177.16,37.78 | 177.16,37.78 177.16,23.18 | 177.16,23.18 177.16,11.75 ]1.10 ]1.8 | +1.8 +1.10 176.85,23.49 177.16,23.18 | 0.8 0.10 177.16,37.78 | _.8 _.10 177.16,52.71 | ].10 177.16,66.67 | R28.1 39.69,70.17 | R41.1 46.99,70.8 47.62,70.17 | R38.1 54.3,70.17 54.29,70.17 | R52.1 61.6,70.17 61.59,70.17 | R61.1 68.9,70.49 68.58,70.17 | R16.1 117.16,67.62 117.16,67.63 | R17.1 117.48,62.23 117.16,62.55 | R29.1 117.16,56.83 | R14.1 117.47,51.43 117.16,51.12 | R26.1 117.16,46.04 | R27.1 117.16,40.64 | R39.1 117.16,35.24 | R40.1 117.16,29.84 117.16,29.85 | R53.1 117.16,24.44 117.16,24.45 | R54.1 117.16,19.05 | R62.1 117.16,13.65 | LED3.K X2.2 8.52,67.94 5.08,67.94 3.81,66.67 3.81,61.91 5.4,60.32 11.43,60.32 22,70.89 22,72.62 | IC2.1 22,72.62
  pour Bottom (isolate 0.8): 183.77,88.98 117.27,89.28 117.27,-1.42 183.66,-1.42 183.66,88.98
M1A
  Bottom 0.508: 97.79,53.98 100.33,53.98
  Bottom 0.61: PCB1.22 97.79,53.98 | 100.33,53.98 107.63,61.28 R21.2
M1A'  (via drill 0.8 pad 1.27)
  Top 0.61: v124.14,60.32 v131.76,60.32 | v134.62,64.13 v134.62,66.67 | v146.37,73.98 v155.89,73.98
  Bottom 0.61: OK4.3 v124.14,60.32 | v134.62,66.67 134.62,76.52 135.89,77.79 -.1 v146.37,73.98 | v134.62,64.13 131.76,61.28 v131.76,60.32 | v155.89,73.98 156.53,73.98 160.34,77.79 +.1
  Bottom 1.016: R17.2 OK4.3
M1B
  Bottom 0.61: PCB1.23 99.69,55.25 105.73,61.28 105.73,64.45 107.63,66.36 R20.2
M1B'  (via drill 0.8 pad 1.27)
  Top 0.61: v124.46,66.67 v133.03,66.67 | v133.03,77.79 v133.03,80.33 | v158.75,84.14 v158.75,80.33
  Bottom 0.61: OK3.3 123.51,65.72 v124.46,66.67 | v133.03,66.67 v133.03,77.79 | v133.03,80.33 -.2 146.37,84.14 v158.75,84.14 | v158.75,80.33 +.2
  Bottom 1.016: R16.2 OK3.3
M2A
  Bottom 0.508: 97.79,51.44 107,51.44
  Bottom 0.61: PCB1.24 97.79,51.44 | 107,51.44 R18.2
M2A'  (via drill 0.8 pad 1.27)
  Top 0.61: v124.14,49.53 v131.76,49.53 | v134.62,49.53 v134.62,52.71 | v146.37,60.01 v155.58,60.01
  Bottom 0.61: OK1.3 v124.14,49.53 | v131.76,49.53 v134.62,49.53 | v134.62,52.71 134.62,60.01 138.75,64.13 ..1 142.56,63.82 v146.37,60.01 | v155.58,60.01 155.58,61.91 157.8,64.13 ].1
  Bottom 1.016: R14.2 OK1.3
M2B
  Bottom 0.61: PCB1.25 102.87,52.71 R33.2
M2B'  (via drill 0.8 pad 1.27)
  Top 0.61: v123.83,54.93 v131.76,54.93 | v136.21,64.13 v136.21,66.67 | v146.37,72.39 v155.89,72.39
  Bottom 0.61: OK8.3 v123.83,54.93 | v131.76,54.93 133.35,56.52 133.35,60.64 136.21,63.5 v136.21,64.13 | v136.21,66.67 ..2 142.56,69.21 145.73,72.39 v146.37,72.39 | v155.89,72.39 155.89,68.58 157.8,66.67 ].2
  Bottom 1.016: R29.2 OK8.3
M3A
  Bottom 0.508: 100.33,48.9 97.79,48.9
  Bottom 0.61: R31.2 107.63,41.59 100.33,48.9 | 97.79,48.9 PCB1.26
M3A'  (via drill 0.8 pad 1.27)
  Top 0.61: v124.14,38.73 v131.76,38.73 | v146.37,46.04 v155.58,46.04
  Bottom 0.61: OK6.3 v124.14,38.73 | v131.76,38.73 131.76,41.59 140.34,50.16 =.1 142.56,49.85 v146.37,46.04 | v155.58,46.04 155.58,47.94 157.8,50.16 _.1
  Bottom 0.813: R27.2 OK6.3
M3B
  Bottom 0.61: R30.2 103.82,46.67 100.33,50.16 PCB1.27
M3B'  (via drill 0.8 pad 1.27)
  Top 0.61: v124.14,44.13 v132.08,44.13 | v136.21,49.53 v136.21,52.71 | v155.58,58.42 v146.37,58.42
  Bottom 0.61: OK5.3 v124.14,44.13 | v132.08,44.13 136.21,48.26 v136.21,49.53 | v136.21,52.71 =.2 142.56,55.25 145.73,58.42 v146.37,58.42 | _.2 157.48,52.71 155.58,54.61 v155.58,58.42
  Bottom 0.813: R26.2 OK5.3
M4A
  Bottom 0.508: 100.01,46.36 97.79,46.36
  Bottom 0.61: R44.2 104.46,33.66 104.46,41.91 100.01,46.36 | 97.79,46.36 PCB1.28
M4A'  (via drill 0.8 pad 1.27)
  Top 0.61: v124.14,27.94 v129.86,27.94 | v146.37,31.11 v155.58,31.11
  Bottom 0.61: OK11.3 v124.14,27.94 | v129.86,27.94 130.18,27.94 137.48,35.24 ,.1 142.56,34.93 v146.37,31.11 | v155.58,31.11 155.58,33.02 157.8,35.24 0.1
  Bottom 0.813: OK11.3 R40.2
M4B
  Bottom 0.61: R43.2 105.41,38.1 105.41,42.55 100.33,47.62 PCB1.29
M4B'  (via drill 0.8 pad 1.27)
  Top 0.61: v124.14,33.34 v130.18,33.34 | v134.3,35.24 v134.3,37.78 | v146.05,44.13 v155.58,44.13
  Bottom 0.61: OK10.3 v124.14,33.34 | v130.18,33.34 132.4,33.34 v134.3,35.24 | v134.3,37.78 ,.2 142.56,40.64 v146.05,44.13 | v155.58,44.13 155.58,40.01 157.8,37.78 0.2
  Bottom 0.813: R39.2 OK10.3
M5A
  Bottom 0.508: 100.01,41.28 97.79,41.28
  Bottom 0.61: R58.2 102.55,24.76 102.55,38.73 100.01,41.28 | 97.79,41.28 PCB1.32
M5A'  (via drill 0.8 pad 1.27)
  Top 0.61: v124.14,17.14 v128.91,17.14 | v155.89,17.14 v146.69,17.14
  Bottom 0.61: 142.88,20.64 -1.1 | OK16.3 v124.14,17.14 | v128.91,17.14 128.91,20 129.86,20.95 -1.1 | +1.1 157.8,20.95 155.89,19.05 v155.89,17.14 | v146.69,17.14 146.37,17.14 -1.1
  Bottom 0.813: R54.2 OK16.3
M5B
  Bottom 0.61: PCB1.33 100.01,42.55 103.5,39.05 103.5,29.21 R57.2
M5B'  (via drill 0.8 pad 1.27)
  Top 0.61: v124.78,23.49 v130.81,23.49 | v155.58,29.53 v146.37,29.53
  Bottom 0.61: OK15.3 123.83,22.54 v124.78,23.49 | v130.81,23.49 -1.2 142.56,26.35 145.73,29.53 v146.37,29.53 | +1.2 157.8,23.49 155.58,25.72 v155.58,29.53
  Bottom 0.813: R53.2 OK15.3
M6A
  Bottom 0.508: 97.79,38.73 99.69,38.73
  Bottom 0.61: PCB1.34 97.79,38.73 | 99.69,38.73 100.65,37.78 100.65,15.88 R55.2
M6A'  (via drill 0.8 pad 1.27)
  Top 0.61: v134.62,3.49 v159.07,3.49
  Bottom 0.61: OK13.3 123.19,6.35 124.14,7.3 134.62,7.3 | 134.62,7.3 .1.1 | v159.07,3.49 159.07,5.4 161.29,7.3 ]1.1 | v134.62,3.49 134.62,7.3
  Bottom 0.813: R51.2 OK13.3
M6B
  Bottom 0.61: R64.2 107.63,14.6 101.6,20.64 101.6,38.42 100.01,40.01 PCB1.35
M6B'  (via drill 0.8 pad 1.27)
  Top 0.61: v124.14,11.75 v128.91,11.75 | v155.89,15.56 v146.69,15.56
  Bottom 0.61: OK20.3 v124.14,11.75 | v128.91,11.75 130.81,9.84 .1.2 142.56,13.02 145.1,15.56 v146.69,15.56 | ]1.2 157.8,9.84 155.89,11.75 v155.89,15.56
  Bottom 0.813: R62.2 OK20.3
N$1  (1 unrouted)
N$3
  Bottom 0.813: LED1.A R1.1
N$4
  Bottom 0.813: LED2.A 21.91,53.66 R2.1
N$6
  Bottom 0.813: C2.- 19.05,20.16 IC1.1
N$9
  Bottom 1.016: R18.1 OK1.1
N$10
  Bottom 0.813: OK2.1 R19.1
N$11
  Bottom 1.016: OK3.1 R20.1
N$12
  Bottom 1.016: OK4.1 R21.1
N$13  (1 unrouted)
N$18
  Bottom 1.016: OK5.1 R30.1
N$19
  Bottom 1.016: OK6.1 R31.1
N$20
  Bottom 0.813: OK7.1 R32.1
N$21
  Bottom 1.016: OK8.1 R33.1
N$29
  Bottom 0.813: LED3.A 8.89,75.25 10.16,76.52 R46.1
N$30
  Bottom 0.813: X2.1 10.19,62.89 17.46,70.17 17.46,73.33 IC2.3
N$37
  Bottom 0.813: OK9.1 R42.1
N$38
  Bottom 1.016: OK10.1 R43.1
N$39
  Bottom 1.016: OK11.1 R44.1
N$40
  Bottom 0.813: OK12.1 R45.1
N$43
  Bottom 1.016: OK13.1 R55.1
N$44
  Bottom 0.813: OK14.1 R56.1
N$45
  Bottom 1.016: OK15.1 R57.1
N$46
  Bottom 1.016: OK16.1 R58.1
N$50
  Bottom 0.813: OK19.1 R63.1
N$51
  Bottom 1.016: OK20.1 R64.1
PB1
  Bottom 0.61: TOMBOL.1 PCB1.36
PB2
  Bottom 0.61: PCB1.38 TOMBOL.2
PB3
  Bottom 0.508: 97.79,36.2 84.77,36.2
  Bottom 0.61: PCB1.37 97.79,36.2 | 84.77,36.2 TOMBOL.3
PB4
  Bottom 0.508: 97.79,33.66 84.77,33.66
  Bottom 0.61: PCB1.39 97.79,33.66 | 84.77,33.66 TOMBOL.4
PB5
  Bottom 0.61: TOMBOL.5 82.23,36.2 82.23,33.34 82.87,32.7 94.93,32.7 95.25,32.39 PCB1.40
PB6
  Bottom 0.508: 97.79,31.11 95.25,31.11
  Bottom 0.61: 97.79,31.11 PCB1.41 | TOMBOL.6 80.96,33.34 82.55,31.75 94.62,31.75 95.25,31.11
PN1
  Bottom 0.508: 61.28,36.2 61.28,33.34
  Bottom 0.61: PN1-4.5 61.28,36.2 | 61.28,33.34 63.5,31.11 67.94,31.11 73.98,25.08 89.22,25.08 89.53,24.76 PCB1.46
PN2
  Bottom 0.508: 88.27,23.49 97.79,23.49
  Bottom 0.61: PN1-4.6 60.01,33.34 63.18,30.16 67.63,30.16 73.66,24.13 87.63,24.13 88.27,23.49 | PCB1.47 97.79,23.49
PN3
  Bottom 0.508: 58.74,36.2 58.74,33.02
  Bottom 0.61: PN1-4.7 58.74,36.2 | 58.74,33.02 62.55,29.21 67.31,29.21 73.34,23.18 86.68,23.18 87.63,22.22 PCB1.48
PN4
  Bottom 0.508: 94.93,20.95 97.79,20.95
  Bottom 0.61: PN1-4.8 57.47,33.02 62.23,28.26 66.68,28.26 72.71,22.22 85.72,22.22 86.68,21.27 94.62,21.27 94.93,20.95 | 97.79,20.95 PCB1.49
PN5
  Bottom 0.61: PN1-4.1 71.12,37.47 72.39,36.2 72.39,32.39 75.88,28.89 86.36,28.89 87.31,29.85 PCB1.42
PN6
  Bottom 0.508: 88.27,28.57 97.79,28.57
  Bottom 0.61: PN1-4.2 70.17,34.93 71.12,33.97 71.12,32.39 75.56,27.94 87.63,27.94 88.27,28.57 | PCB1.43 97.79,28.57
PN7
  Bottom 0.508: 63.82,36.2 63.82,33.66
  Bottom 0.61: PN1-4.3 63.82,36.2 | 63.82,33.66 64.45,33.02 69.22,33.02 75.25,26.99 88.9,26.99 89.22,27.3 PCB1.44
PN8
  Bottom 0.508: 74.61,26.04 97.79,26.04
  Bottom 0.61: PN1-4.4 62.55,33.34 63.82,32.07 68.58,32.07 74.61,26.04 | PCB1.45 97.79,26.04
PWM1
  Bottom 0.813: R19.2 33.65,61.91 35.24,60.32 40,60.32 41.59,58.74 41.59,57.85 PCB1.9
PWM1'  (via drill 0.8 pad 1.27)
  Top 0.61: v36.2,85.72 v36.2,74.3
  Bottom 0.51: 125.09,79.06 144.78,79.06
  Bottom 0.61: v36.2,85.72 118.43,85.72 125.09,79.06 | v36.2,74.3 OK2.3 | 145.1,78.74 -.4 147.64,82.87 168.59,82.87 170.18,81.28 +.6 | 145.1,78.74 -.3 | 144.78,79.06 145.1,78.74
  Bottom 0.813: OK2.3 34.29,72.71 R15.2
PWM2
  Bottom 0.813: R32.2 41.59,62.55 44.13,60.01 44.13,57.85 PCB1.8
PWM2'  (via drill 0.8 pad 1.27)
  Top 0.61: v43.18,84.45 v43.18,74.3 | v146.37,70.8 v158.75,70.8
  Bottom 0.51: 132.4,65.41 145.1,65.41
  Bottom 0.61: ..3 145.1,65.41 ..4 145.1,69.53 v146.37,70.8 | R28.2 OK7.3 v43.18,74.3 | v43.18,84.45 118.11,84.45 131.44,71.12 131.44,66.36 132.4,65.41 | v158.75,70.8 166.05,70.8 ].6
PWM3
  Bottom 0.813: R45.2 48.26,60.64 PCB1.7
PWM3'  (via drill 0.8 pad 1.27)
  Top 0.61: v51.12,83.19 v51.12,74.3 | v146.37,56.83 v158.75,56.83
  Bottom 0.51: 132.08,51.44 145.1,51.44
  Bottom 0.61: =.3 145.1,51.44 =.4 145.1,55.56 v146.37,56.83 | R41.2 OK12.3 v51.12,74.3 | v51.12,83.19 118.11,83.19 130.49,70.8 130.49,53.02 132.08,51.44 | v158.75,56.83 165.74,56.83 _.6
PWM4
  Bottom 0.813: R42.2 51.75,60.96 50.8,59.38 PCB1.6
PWM4'  (via drill 0.8 pad 1.27)
  Top 0.61: v58.1,81.91 v58.1,74.3 | v158.75,41.91 v146.37,41.91
  Bottom 0.51: 130.81,36.51 144.78,36.51
  Bottom 0.61: 145.1,36.2 ,.4 145.1,40.96 146.05,41.91 v146.37,41.91 | 145.1,36.2 ,.3 | R38.2 OK9.3 v58.1,74.3 | v58.1,81.91 118.11,81.91 129.54,70.48 129.54,37.78 130.81,36.51 | 144.78,36.51 145.1,36.2 | 0.6 165.74,41.91 v158.75,41.91
PWM5
  Bottom 0.813: R56.2 58.1,62.55 53.34,58.42 PCB1.5
PWM5'  (via drill 0.8 pad 1.27)
  Top 0.61: v65.72,80.64 v65.72,74.3 | v158.75,27.94 v146.37,27.94
  Bottom 0.51: 129.86,22.22 145.1,22.22
  Bottom 0.61: -1.3 145.1,22.22 -1.4 145.1,26.67 v146.37,27.94 | R52.2 OK14.3 v65.72,74.3 | v65.72,80.64 118.11,80.64 128.59,70.17 128.59,23.49 129.86,22.22 | +1.6 165.74,27.94 v158.75,27.94
PWM6
  Bottom 0.813: R63.2 66.36,61.6 64.45,60.01 57.47,60.01 55.88,58.74 PCB1.4
PWM6'  (via drill 0.8 pad 1.27)
  Top 0.61: v72.39,79.38 v72.39,74.3 | v158.75,13.97 v146.69,13.97
  Bottom 0.51: 128.91,8.57 144.78,8.57
  Bottom 0.61: .1.3 145.1,8.89 | 145.1,8.89 .1.4 145.1,12.38 v146.69,13.97 | R61.2 OK19.3 v72.39,74.3 | v72.39,79.38 118.11,79.38 127.63,69.85 127.63,9.84 128.91,8.57 | 144.78,8.57 145.1,8.89 | ]1.6 169.54,9.84 169.86,10.16 166.05,13.97 v158.75,13.97
RST  (via drill 0.8 pad 1.27)  (1 unrouted)
  Top 0.813: v41.59,41.59 v30.8,41.59
  Bottom 0.61: TOMBOL.7 78.42,38.1 74.93,41.59 50.8,41.59
  Bottom 0.813: PCB1.RESET 28.58,16.51 28.58,27.3 | 28.58,27.3 32.7,31.43 32.7,34.14 RESET.3 32.7,34.24 32.7,39.69 v30.8,41.59 | JP3.1 28.58,27.3 | 50.8,41.59 v41.59,41.59
RX  (1 unrouted)
  Bottom 0.813: UART1.1 79.38,61.6 79.38,61.28 78.74,60.64 PCB1.17
SCL
  Bottom 0.61: I2C.1 22.54,61.91 21.27,60.64 21.27,57.85 PCB1.SCL1
SDA
  Bottom 0.61: PCB1.SDA1 23.88,57.85 26.03,60.01 26.03,63.18 24.77,64.45 I2C.2
TX  (1 unrouted)
  Bottom 0.813: UART1.2 78.1,64.13 76.2,62.23 PCB1.16
(copper drawn outside any net)
  shapes: Top area x7165